# Altium schematic sheet Middle_B2B.SchDoc
size A4
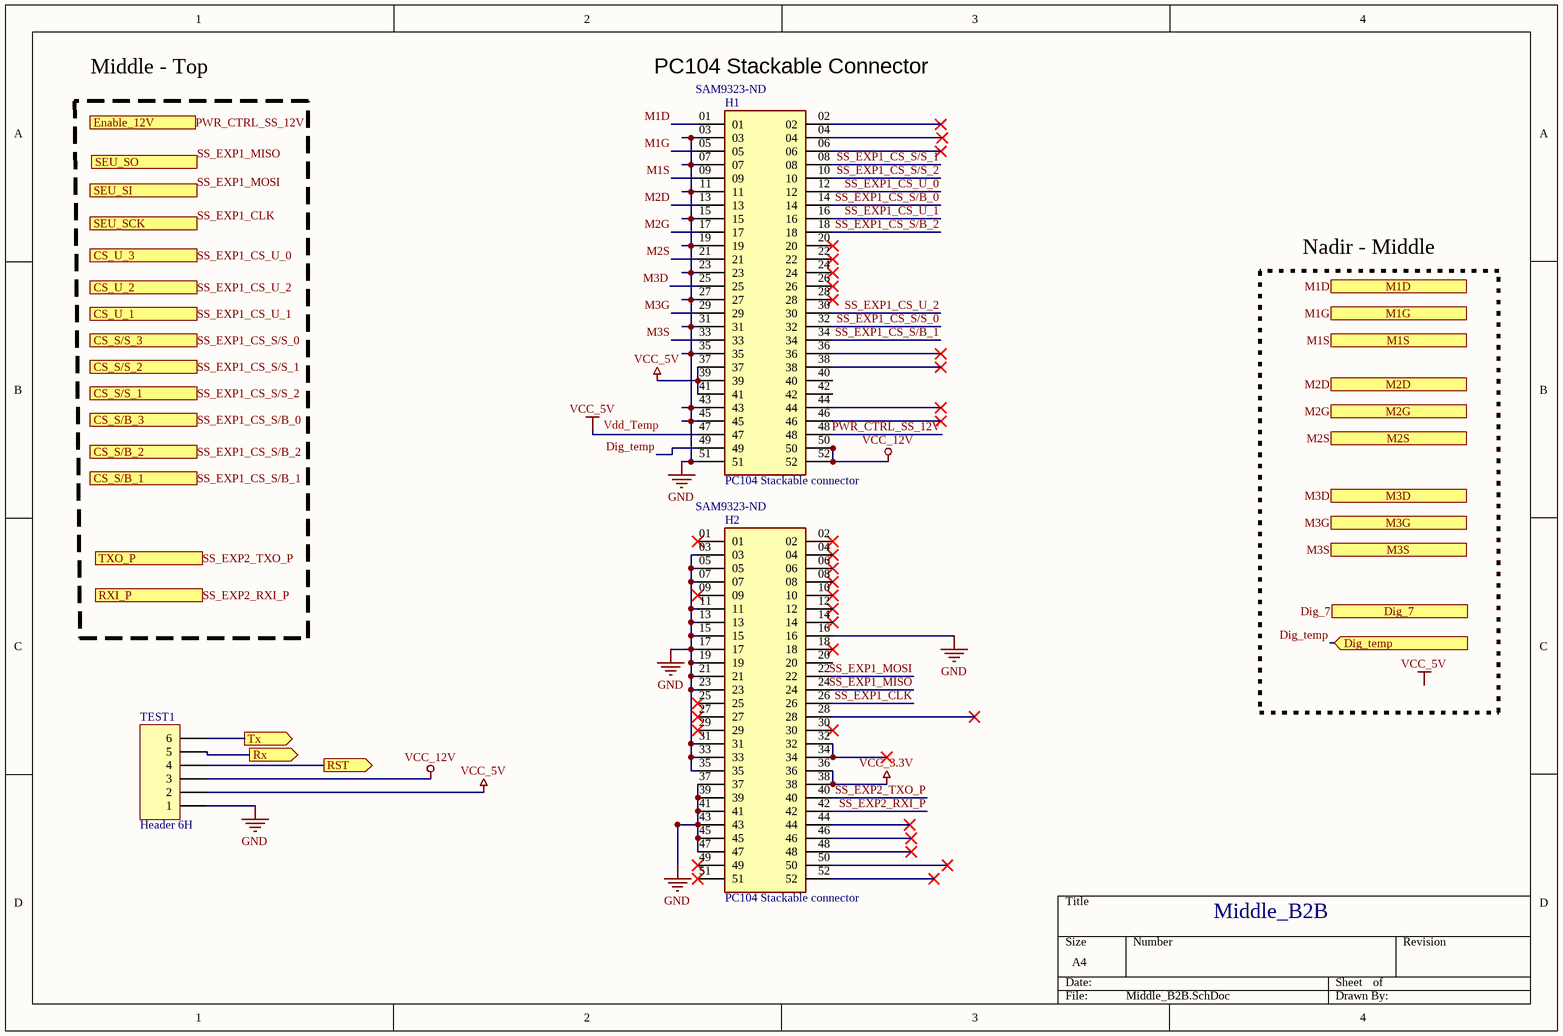
[diagram p0: Middle_B2B.SchDoc]

## Parts
H1  PC104 Stackable connector  Supplier Part Number 1: SAM9323-ND  [SAMTEC_ESQ-126-39-G-D]
H2  PC104 Stackable connector  Supplier Part Number 1: SAM9323-ND  [SAMTEC_ESQ-126-39-G-D]
TEST1  Header 6H  [HDR1X6H]

## Ports
CS_S/B_1 (out), CS_S/B_2 (out), CS_S/B_3 (out), CS_S/S_1 (out), CS_S/S_2 (out), CS_S/S_3 (out), CS_U_1 (out), CS_U_2 (out), CS_U_3 (out), Dig_7 (in), Dig_temp (in), Enable_12V (out), M1D (in), M1G (in), M1S (in), M2D (in), M2G (in), M2S (in), M3D (in), M3G (in), M3S (in), RST (out), Rx (out), RXI_P (out), SEU_SCK (out), SEU_SI (out), SEU_SO (in), Tx (out), TXO_P (in)

## Nets
GND: H1.03 H1.07 H1.11 H1.15 H1.19 H1.23 H1.27 H1.31 H1.35 H1.43 H1.45 H1.51 H2.03 H2.05 H2.07 H2.11 H2.13 H2.15 H2.16 H2.17 H2.19 H2.21 H2.23 H2.31 H2.33 H2.35 H2.37 H2.39 H2.41 H2.43 H2.45 H2.47 TEST1.1
VCC_3.3V: H2.36 H2.38
VCC_5V: H1.37 H1.39 H1.41 H1.47 TEST1.2
VCC_12V: H1.50 H1.52 TEST1.3
Dig_7: port Dig_7
Dig_temp: H1.49 ; port Dig_temp
M1D: H1.01 ; port M1D
M1G: H1.05 ; port M1G
M1S: H1.09 ; port M1S
M2D: H1.13 ; port M2D
M2G: H1.17 ; port M2G
M2S: H1.21 ; port M2S
M3D: H1.25 ; port M3D
M3G: H1.29 ; port M3G
M3S: H1.33 ; port M3S
PWR_CTRL_SS_12V: H1.48 ; port Enable_12V
RST: TEST1.4 ; port RST
Rx: TEST1.5 ; port Rx
SS_EXP1_CLK: H2.26 ; port SEU_SCK
SS_EXP1_CS_S/B_0: H1.14 ; port CS_S/B_3
SS_EXP1_CS_S/B_1: H1.34 ; port CS_S/B_1
SS_EXP1_CS_S/B_2: H1.18 ; port CS_S/B_2
SS_EXP1_CS_S/S_0: H1.32 ; port CS_S/S_3
SS_EXP1_CS_S/S_1: H1.08 ; port CS_S/S_2
SS_EXP1_CS_S/S_2: H1.10 ; port CS_S/S_1
SS_EXP1_CS_U_0: H1.12 ; port CS_U_3
SS_EXP1_CS_U_1: H1.16 ; port CS_U_1
SS_EXP1_CS_U_2: H1.30 ; port CS_U_2
SS_EXP1_MISO: H2.24 ; port SEU_SO
SS_EXP1_MOSI: H2.22 ; port SEU_SI
SS_EXP2_RXI_P: H2.42 ; port RXI_P
SS_EXP2_TXO_P: H2.40 ; port TXO_P
Tx: TEST1.6 ; port Tx
NetH2_32: H2.32 H2.34

Not connected (* = marked no-connect by the designer): H1 02* 04* 06* 20* 22* 24* 26* 28* 36* 38* 40 42 44* 46*; H2 01* 02* 04* 06* 08* 09* 10* 12* 14* 18* 20 25* 27* 28* 29* 30* 44* 46* 48* 49* 50* 51* 52*

## Notes on the sheet
- Middle - Top
- (near H1) PC104 Stackable Connector
- Nadir - Middle
- Vdd_Temp
- Middle_B2B
- Labels drawn without touching a wire or pin: VCC_5V

## Library data of the parts
H1 H2 = SAMTEC_ESQ-126-39-G-D: Header_2x26_2.54mm; Supplier 1: Digi-Key
TEST1 = Header 6H: Header, 6-Pin, Right Angle; LatestRevisionDate: 17-Jul-2002; LatestRevisionNote: Re-released for DXP Platform.; Publisher: Altium Limited